# EAGLE design usb-led (EAGLE 6.6.0)
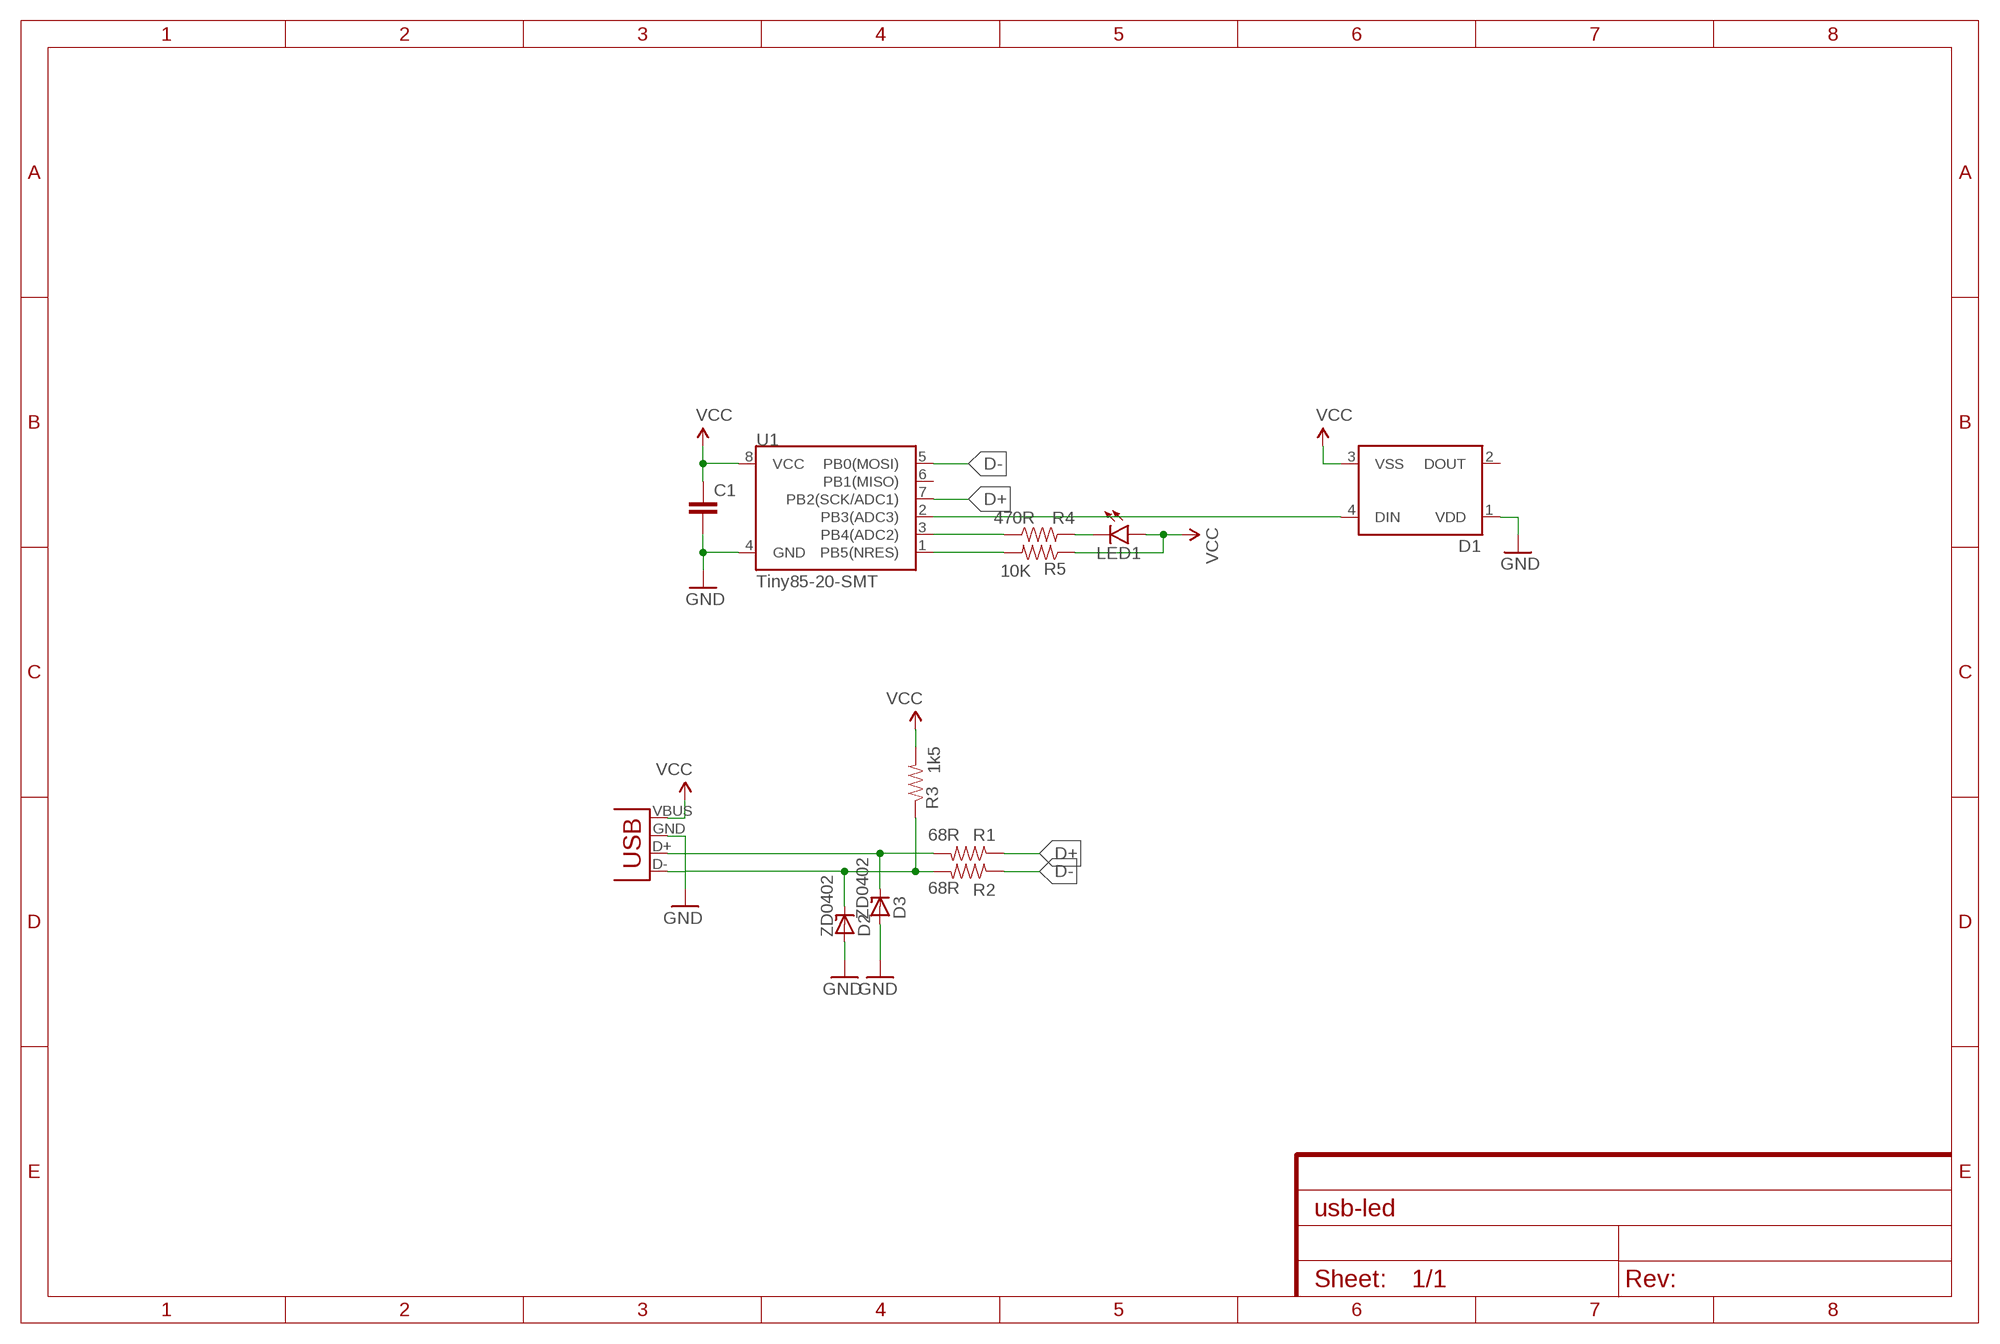
[diagram p0: schematic, sheet 1]

## Parts
C1  CAP0805  [0805]
D1  WS2812B  [WS2812B]
D2  ZD0402  [ZD0402]
D3  ZD0402  [ZD0402]
JP2  USB-A-H  [USB-A-H]
LED1  LED0603  [LED-0603]
R1  68R  RESISTOR0402-RES  [0402-RES]
R2  68R  RESISTOR0402-RES  [0402-RES]
R3  1k5  RESISTOR0402-RES  [0402-RES]
R4  470R  RESISTOR0603  [0603-RES]
R5  10K  RESISTOR0402-RES  [0402-RES]
U1  Tiny85-20-SMT  ATTINY45TINY85-20-SMT  [SO08-EIAJ]

## Nets
D+: R1.1 U1.7(PB2(SCK/ADC1))
D-: R2.1 U1.5(PB0(MOSI))
GND: C1.2 D1.1(VDD) D2.A D3.A JP2.GND(VBUS) U1.4(GND)
N$1: D3.K(C) JP2.D+(D-) R1.2
N$2: D2.K(C) JP2.D-(D+) R2.2 R3.1
N$3: R4.1 U1.3(PB4(ADC2))
N$4: LED1.C R4.2
N$5: R5.2 U1.1(PB5(NRES))
N$7: D1.4(DIN) U1.2(PB3(ADC3))
VCC: C1.1 D1.3(VSS) JP2.VBUS(GND) LED1.A R3.2 R5.1 U1.8(VCC)
Unconnected: D1.2(DOUT) U1.6(PB1(MISO))

## Library data of the parts
C1 = SparkFun-Passives:CAP: Capacitor Standard 0603 ceramic capacitor, and 0.1" leaded capacitor.
D1 = SparkFun-LED:WS2812B: WS2812B - Intelligent control LED integrated light source Technical Specifications: Power Supply Voltage (VDD): 3.5 to 5.3 V Input Voltage (VI): -0.5 to VDD+0.5 V Operating Junction Temperature (Topt): -25°C to +80°C Storage Temperature Range (Tstg): -55°C to +150°C
D2 D3 = z-diode-0402:ZD0402: Z DIODE
JP2 = SparkFun-Connectors:USB: USB Connectors USB-B-PTH is fully proven SKU : PRT-00139/CONN-08278 USB-miniB is fully proven SKU : PRT-00587 USB-A-PCB is untested. USB-A-H is throughly reviewed, but untested. Spark Fun Electronics SKU : PRT-00437 USB-B-SMT is throughly reviewed, but untested. Needs silkscreen touching up. USB-A-S has not been used/tested USB-MB-H has not been used/tested USB-MICROB has been used. CONN-09505
LED1 = SparkFun-LED:LED: LEDs Standard schematic elements and footprints for 5mm, 3mm, 1206, and 0603 sized LEDs. 5mm - Spark Fun Electronics SKU : COM-00529 (and others)
R1-R3 R5 = SparkFun-Passives:RESISTOR: Resistor Basic schematic elements and footprints for 0603, 1206, and PTH resistors.
R4 = SparkFun-Resistors:RESISTOR: Resistor Basic schematic elements and footprints for 0603, 1206, and PTH resistors.
U1 = SparkFun-DigitalIC:ATTINY45: Atmel 8-pin 2/4/8kB flash uC; PROD_ID: IC-09092

## Board
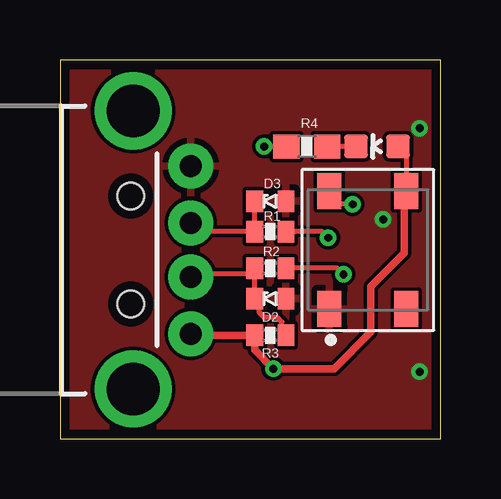
[diagram p1: board, top side]
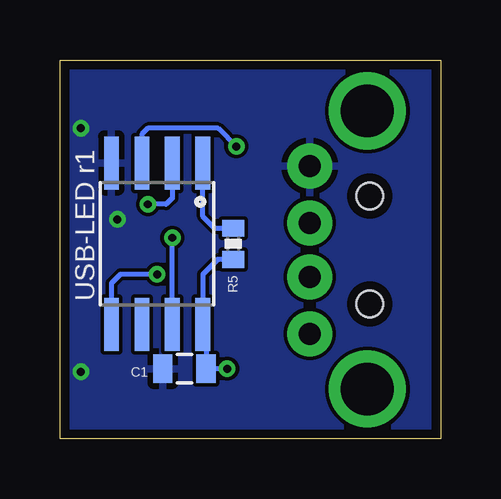
[diagram p2: board, bottom side, seen from below]

Size 15.85 x 15.8 mm. Coordinates in mm from the lower left corner, seen from the top.
Outline: 0,0 15.85,0 15.85,15.8 0,15.8 0,0
Copper layers (1*16): Top 0.0356mm / dielectric 1.5011mm / Bottom 0.0356mm
Design rules "LaenPCBOrder *": minimum track width 8mil, minimum drill 13mil, track to track 6mil, track to pad 6mil, pad to pad 6mil, via to via 6mil, smd to smd 6mil, copper to edge 15mil, drill to drill 6mil, minimum pad ring 7mil, minimum via ring 7mil, stop-mask expansion 3mil, vias tented up to drill 0mil, thermal gap 10mil

### Footprints (pad centres in the part's own frame; a part is rotated, then mirrored left to right if it is on the bottom)
0805 = smd 0.8 x 1.2: 1 -0.9,0; 2 0.9,0
WS2812B = smd 1.5 x 1: 1 -2.45,1.6; 2 -2.45,-1.6; 3 2.45,-1.6; 4 2.45,1.6
ZD0402 = smd 0.7 x 0.9: A -0.65,0; K 0.65,0
USB-A-H = drill 0.914 pad 1.88: D+ 2.4,1.127; D- 2.4,-1.127; GND 2.4,3.5; VBUS 2.4,-3.5 | drill 2.2: GND2 0,-5.8; GND3 0,5.8 | hole 1.1: -0.1,2.25; -0.1,-2.25
LED-0603 = smd 1 x 1: A 0,-0.877; C 0,0.877
0402-RES = smd 0.7 x 0.9: 1 -0.65,0; 2 0.65,0
0603-RES = smd 1.1 x 1: 1 -0.85,0; 2 0.85,0
SO08-EIAJ = smd 0.61 x 2.21: 1 -1.905,-3.378; 2 -0.635,-3.378; 3 0.635,-3.378; 4 1.905,-3.378; 5 1.905,3.353; 6 0.635,3.353; 7 -0.635,3.353; 8 -1.905,3.353

### Placement (x,y rotation side)
C1  10.67,2.92 180 bottom
D1  12.83,7.87 90 top
D2  8.76,5.84 180 top
D3  8.76,9.91 180 top
JP2  3.05,7.87 0 top
LED1  13.21,12.19 90 top
R1  8.76,8.64 180 top
R2  8.76,7.11 180 top
R3  8.76,4.32 180 top
R4  10.29,12.19 0 top
R5  8.64,8.13 90 bottom
U1  11.81,8.13 180 bottom

### Tracks (layer width: path | path; a pad name or v marks a point on that pad's centre or on a via)
D+  (via drill 0.33)
  Top 0.203: v11.18,8.38 10.92,8.64 R1.1 9.79,8.64
  Bottom 0.203: U1.7 v11.18,8.38
D-  (via drill 0.33)
  Top 0.203: v11.81,6.86 11.56,7.11 R2.1
  Bottom 0.203: v11.81,6.86 13.34,6.86 13.72,6.48 U1.5
GND  (via drill 0.33)
  other vias: 14.99,12.95 14.99,2.79 13.46,9.14
  pour Bottom: 0.13,0.13 15.62,0.13 15.62,15.62 0.13,15.62
  pour Top: 0.13,0.13 15.62,0.13 15.62,15.62 0.13,15.62
N$1
  Top 0.203: D3.K R1.2 5.81,8.64 JP2.D+
N$2
  Top 0.203: R3.1 9.25,4.48 9.25,4.88 9.07,5.05 8.51,5.05 8.31,5.26 8.31,5.65 D2.K R2.2 8,6.87 5.57,6.87 JP2.D-
N$3  (via drill 0.33)
  Top 0.203: R4.1 v8.51,12.19
  Bottom 0.203: v8.51,12.19 9.27,12.95 12.19,12.95 12.45,12.7 U1.3
N$4
  Top 0.203: LED1.C R4.2
N$5
  Bottom 0.203: R5.2 9.41,8.78 9.91,9.27 U1.1
N$7  (via drill 0.33)
  Top 0.203: v12.19,9.78 11.23,9.78 D1.4
  Bottom 0.203: U1.2 11.18,10.03 11.43,9.78 v12.19,9.78
VCC  (via drill 0.33)
  Top 0.203: 14.35,10.25 D1.3 14.43,12.19 LED1.A
  Top 0.305: 14.35,10.25 14.35,7.75 12.95,6.35 12.95,4.45 11.43,2.92 v8.89,2.92 8.11,3.7 R3.2 5.45,4.32 JP2.VBUS
  Bottom 0.203: v8.89,2.92 C1.1 9.77,4.89 U1.8 9.91,6.86 9.29,7.48 R5.1

### Text on the board
bNames: USB-LED r1